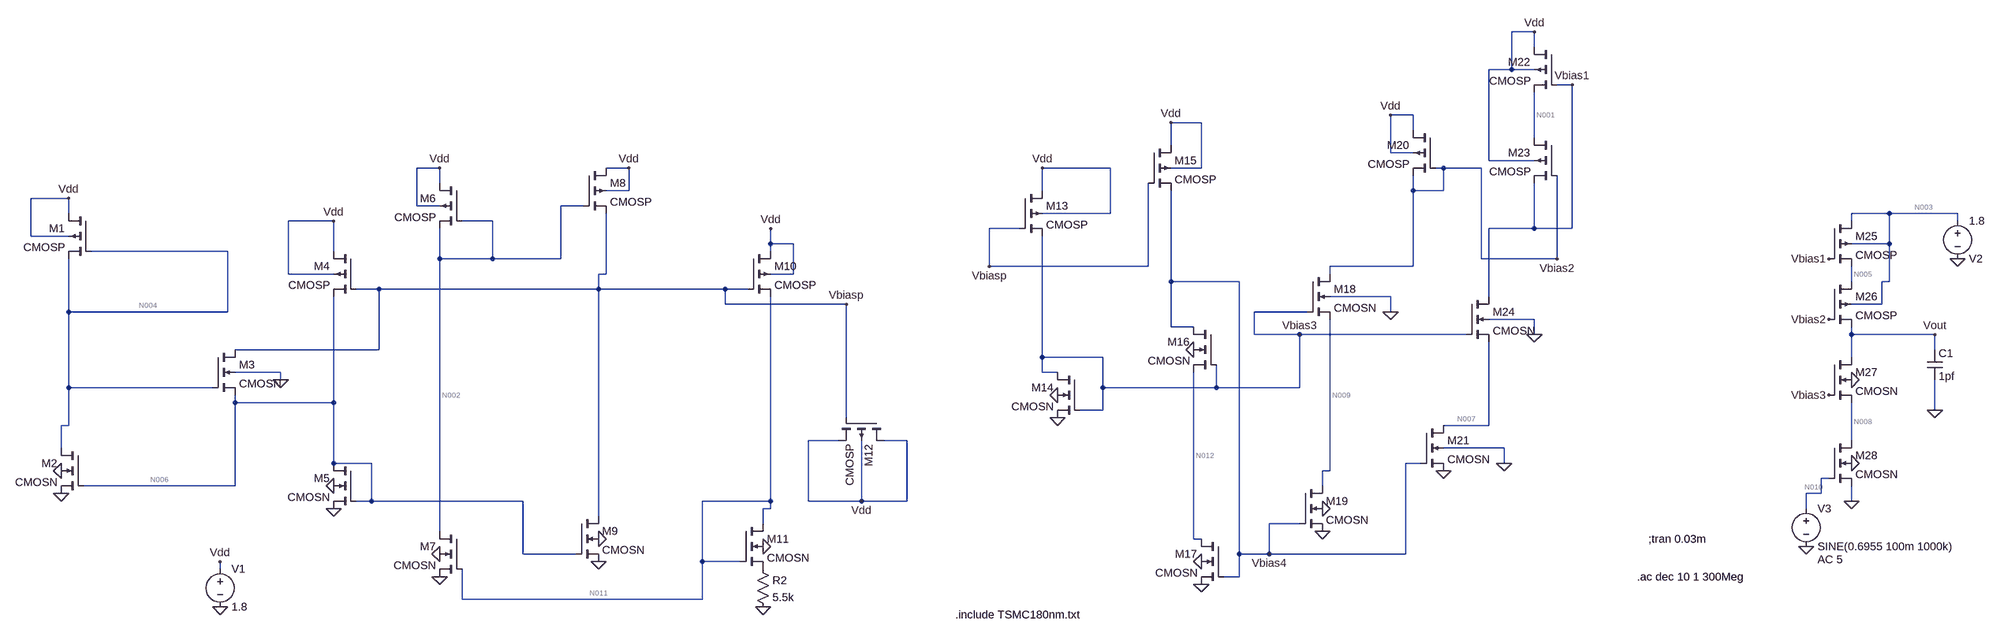
[diagram p0: schematic LTSPICE_180nm.asc]
LTSPICE_180nm.asc, the LTspice schematic file:
Version 4
SHEET 1 5252 2564
WIRE 2800 1024 2752 1024
WIRE 2800 1056 2800 1024
WIRE 2752 1104 2752 1024
WIRE 2752 1104 2704 1104
WIRE 2800 1104 2752 1104
WIRE 2880 1136 2848 1136
WIRE 2544 1200 2496 1200
WIRE 2096 1216 2032 1216
WIRE 2544 1232 2544 1200
WIRE 2800 1248 2800 1152
WIRE 2032 1264 2032 1216
WIRE 2496 1280 2496 1200
WIRE 2544 1280 2496 1280
WIRE 2704 1296 2704 1104
WIRE 2800 1296 2704 1296
WIRE 336 1312 288 1312
WIRE 736 1312 688 1312
WIRE 1904 1312 1760 1312
WIRE 2096 1312 2096 1216
WIRE 2096 1312 2032 1312
WIRE 2608 1312 2592 1312
WIRE 2688 1312 2608 1312
WIRE 336 1344 336 1312
WIRE 736 1360 736 1312
WIRE 736 1360 688 1360
WIRE 1760 1360 1760 1312
WIRE 2544 1360 2544 1328
WIRE 2608 1360 2608 1312
WIRE 2608 1360 2544 1360
WIRE -448 1376 -528 1376
WIRE 288 1392 288 1312
WIRE 336 1392 288 1392
WIRE 640 1392 592 1392
WIRE -448 1408 -448 1376
WIRE 1904 1408 1904 1312
WIRE 1904 1408 1760 1408
WIRE 4064 1408 3984 1408
WIRE 4208 1408 4064 1408
WIRE 112 1424 16 1424
WIRE 448 1424 384 1424
WIRE 3984 1424 3984 1408
WIRE 4208 1424 4208 1408
WIRE 1712 1440 1648 1440
WIRE 2800 1440 2800 1344
WIRE 2800 1440 2704 1440
WIRE 2880 1440 2880 1136
WIRE 2880 1440 2800 1440
WIRE -528 1456 -528 1376
WIRE -448 1456 -528 1456
WIRE 1104 1472 1104 1440
WIRE 1152 1472 1104 1472
WIRE 4064 1472 4064 1408
WIRE 4064 1472 3984 1472
WIRE -112 1488 -400 1488
WIRE 112 1488 112 1424
WIRE 1104 1488 1104 1472
WIRE 336 1504 336 1440
WIRE 448 1504 448 1424
WIRE 448 1504 336 1504
WIRE 592 1504 592 1392
WIRE 592 1504 448 1504
WIRE 2688 1504 2688 1312
WIRE 2848 1504 2848 1328
WIRE 2848 1504 2688 1504
WIRE 1648 1520 1648 1440
WIRE 1984 1520 1984 1344
WIRE 1984 1520 1648 1520
WIRE 2544 1520 2544 1360
WIRE 2544 1520 2368 1520
WIRE 16 1536 16 1424
WIRE 112 1536 16 1536
WIRE 688 1536 688 1408
WIRE 688 1536 672 1536
WIRE 1152 1536 1152 1472
WIRE 1152 1536 1104 1536
WIRE 2368 1536 2368 1520
WIRE 2032 1552 2032 1360
WIRE 2176 1552 2032 1552
WIRE 3984 1552 3984 1520
WIRE 4064 1552 4064 1472
WIRE 4064 1552 4048 1552
WIRE 208 1568 160 1568
WIRE 672 1568 672 1536
WIRE 672 1568 208 1568
WIRE 1008 1568 672 1568
WIRE 1056 1568 1008 1568
WIRE 2496 1584 2368 1584
WIRE 2704 1584 2704 1440
WIRE 1008 1600 1008 1568
WIRE 1264 1600 1008 1600
WIRE 4048 1600 4048 1552
WIRE 4048 1600 3984 1600
WIRE -448 1616 -448 1504
WIRE -112 1616 -112 1488
WIRE -112 1616 -448 1616
WIRE 2320 1616 2208 1616
WIRE 2496 1616 2496 1584
WIRE 2800 1632 2704 1632
WIRE 2032 1648 2032 1552
WIRE 2080 1648 2032 1648
WIRE 2208 1664 2208 1616
WIRE 2304 1664 2208 1664
WIRE 2656 1664 2304 1664
WIRE 2800 1664 2800 1632
WIRE 3984 1664 3984 1648
WIRE 4160 1664 3984 1664
WIRE 208 1696 208 1568
WIRE 208 1696 -96 1696
WIRE 4160 1696 4160 1664
WIRE 1760 1712 1760 1456
WIRE 1888 1712 1760 1712
WIRE 3984 1712 3984 1664
WIRE 0 1744 -96 1744
WIRE 1760 1744 1760 1712
WIRE 1792 1744 1760 1744
WIRE 0 1760 0 1744
WIRE -448 1776 -448 1616
WIRE -144 1776 -448 1776
WIRE 1888 1776 1888 1712
WIRE 2128 1776 2128 1728
WIRE 2128 1776 1888 1776
WIRE 2304 1776 2304 1664
WIRE 2304 1776 2128 1776
WIRE -96 1808 -96 1792
WIRE 112 1808 112 1584
WIRE 112 1808 -96 1808
WIRE 1888 1824 1888 1776
WIRE 1888 1824 1840 1824
WIRE 4160 1824 4160 1760
WIRE 1264 1840 1264 1600
WIRE -448 1856 -448 1776
WIRE -448 1856 -464 1856
WIRE 2704 1856 2704 1680
WIRE 2704 1856 2608 1856
WIRE 1248 1888 1184 1888
WIRE 1392 1888 1344 1888
WIRE 3984 1888 3984 1808
WIRE -464 1904 -464 1856
WIRE 2736 1904 2608 1904
WIRE 112 1936 112 1808
WIRE 192 1936 112 1936
WIRE 2560 1936 2528 1936
WIRE 2736 1936 2736 1904
WIRE 2368 1952 2368 1632
WIRE 2368 1952 2352 1952
WIRE 3936 1968 3920 1968
WIRE -96 1984 -96 1808
WIRE -96 1984 -416 1984
WIRE 2352 1984 2352 1952
WIRE 3920 2000 3920 1968
WIRE 3920 2000 3888 2000
WIRE 192 2016 192 1936
WIRE 192 2016 160 2016
WIRE 512 2016 192 2016
WIRE 1104 2016 1104 1584
WIRE 1104 2016 960 2016
WIRE 1184 2016 1184 1888
WIRE 1296 2016 1296 1888
WIRE 1296 2016 1184 2016
WIRE 1392 2016 1392 1888
WIRE 1392 2016 1296 2016
WIRE 3984 2016 3984 1984
WIRE 1104 2032 1104 2016
WIRE 1104 2032 1088 2032
WIRE 3888 2032 3888 2000
WIRE 672 2048 672 1568
WIRE 1088 2064 1088 2032
WIRE 2304 2064 2240 2064
WIRE 336 2080 336 1504
WIRE 2080 2096 2080 1744
WIRE 2096 2096 2080 2096
WIRE 512 2128 512 2016
WIRE 624 2128 512 2128
WIRE 2176 2128 2176 1552
WIRE 2240 2128 2240 2064
WIRE 2240 2128 2176 2128
WIRE 2528 2128 2528 1936
WIRE 2528 2128 2240 2128
WIRE 960 2144 960 2016
WIRE 1040 2144 960 2144
WIRE -128 2160 -128 2144
WIRE 2176 2176 2176 2128
WIRE 2176 2176 2144 2176
WIRE 384 2224 384 2160
WIRE 960 2224 960 2144
WIRE 960 2224 384 2224
FLAG -464 2000 0
FLAG 112 2032 0
FLAG 336 2176 0
FLAG 672 2144 0
FLAG -464 1952 0
FLAG 112 1984 0
FLAG 336 2128 0
FLAG 672 2096 0
FLAG 1088 2112 0
FLAG 1088 2240 0
FLAG 2096 2192 0
FLAG 2352 2080 0
FLAG 2096 2144 0
FLAG 2352 2032 0
FLAG 1792 1840 0
FLAG 1792 1792 0
FLAG 2080 1696 0
FLAG 2496 1616 0
FLAG 2608 1952 0
FLAG 4160 1824 0
FLAG 4208 1504 0
FLAG 3888 2112 0
FLAG 3984 2016 0
FLAG 4160 1664 Vout
FLAG 3984 1936 0
FLAG 3984 1760 0
FLAG 1264 1600 Vbiasp
FLAG 1648 1520 Vbiasp
FLAG 2304 1664 Vbias3
FLAG 2240 2128 Vbias4
FLAG 2880 1136 Vbias1
FLAG 2848 1504 Vbias2
FLAG 3936 1504 Vbias1
FLAG 3936 1632 Vbias2
FLAG 3936 1792 Vbias3
FLAG -128 2240 0
FLAG -128 2144 Vdd
FLAG -448 1376 Vdd
FLAG 112 1424 Vdd
FLAG 336 1312 Vdd
FLAG 736 1312 Vdd
FLAG 1296 2016 Vdd
FLAG 1104 1440 Vdd
FLAG 1760 1312 Vdd
FLAG 2032 1216 Vdd
FLAG 2496 1200 Vdd
FLAG 2800 1024 Vdd
FLAG 0 1760 0
FLAG 2800 1664 0
FLAG 2736 1936 0
SYMBOL pmos4 -400 1408 M0
SYMATTR InstName M1
SYMATTR Value2 l=3600n w=1800n
SYMATTR Value CMOSP
SYMBOL pmos4 160 1488 M0
SYMATTR InstName M4
SYMATTR Value2 l=360n w=4320n
SYMATTR Value CMOSP
SYMBOL pmos4 384 1344 M0
SYMATTR InstName M6
SYMATTR Value2 l=360n w=4320n
SYMATTR Value CMOSP
SYMBOL pmos4 640 1312 R0
SYMATTR InstName M8
SYMATTR Value2 l=360n w=4320n
SYMATTR Value CMOSP
SYMBOL pmos4 1056 1488 R0
SYMATTR InstName M10
SYMATTR Value2 l=360n w=4320n
SYMATTR Value CMOSP
SYMBOL nmos4 -144 1696 R0
SYMATTR InstName M3
SYMATTR Value2 l=360n w=720n
SYMATTR Value CMOSN
SYMBOL nmos4 -416 1904 M0
SYMATTR InstName M2
SYMATTR Value2 l=360n w=1800n
SYMATTR Value CMOSN
SYMBOL nmos4 160 1936 M0
SYMATTR InstName M5
SYMATTR Value2 l=360n w=1800n
SYMATTR Value CMOSN
SYMBOL nmos4 384 2080 M0
SYMATTR InstName M7
SYMATTR Value2 l=360n w=1800n
SYMATTR Value CMOSN
SYMBOL nmos4 624 2048 R0
SYMATTR InstName M9
SYMATTR Value2 l=360n w=1800n
SYMATTR Value CMOSN
SYMBOL nmos4 1040 2064 R0
SYMATTR InstName M11
SYMATTR Value2 l=360n w=5400n
SYMATTR Value CMOSN
SYMBOL pmos4 1344 1840 R90
SYMATTR InstName M12
SYMATTR Value2 l=9000n w=9000n
SYMATTR Value CMOSP
SYMBOL res 1072 2144 R0
SYMATTR InstName R2
SYMATTR Value 5.5k
SYMBOL nmos4 2144 2096 M0
SYMATTR InstName M17
SYMATTR Value2 l=360n w=1800n
SYMATTR Value CMOSN
SYMBOL nmos4 2304 1984 R0
SYMATTR InstName M19
SYMATTR Value2 l=360n w=1800n
SYMATTR Value CMOSN
SYMBOL nmos4 1840 1744 M0
SYMATTR InstName M14
SYMATTR Value2 l=1206n w=360n
SYMATTR Value CMOSN
SYMBOL nmos4 2128 1648 M0
SYMATTR InstName M16
SYMATTR Value2 l=360n w=1800n
SYMATTR Value CMOSN
SYMBOL nmos4 2320 1536 R0
SYMATTR InstName M18
SYMATTR Value2 l=360n w=1980n
SYMATTR Value CMOSN
SYMBOL nmos4 2560 1856 R0
SYMATTR InstName M21
SYMATTR Value2 l=360n w=1800n
SYMATTR Value CMOSN
SYMBOL nmos4 2656 1584 R0
SYMATTR InstName M24
SYMATTR Value2 l=360n w=1800n
SYMATTR Value CMOSN
SYMBOL pmos4 1712 1360 R0
SYMATTR InstName M13
SYMATTR Value2 l=360n w=4320n
SYMATTR Value CMOSP
SYMBOL pmos4 2592 1232 M0
SYMATTR InstName M20
SYMATTR Value2 l=900n w=1190n
SYMATTR Value CMOSP
SYMBOL pmos4 1984 1264 R0
SYMATTR InstName M15
SYMATTR Value2 l=360n w=4320n
SYMATTR Value CMOSP
SYMBOL pmos4 2848 1056 M0
SYMATTR InstName M22
SYMATTR Value2 l=360n w=1170n
SYMATTR Value CMOSP
SYMBOL pmos4 2848 1248 M0
SYMATTR InstName M23
SYMATTR Value2 l=360n w=3250n
SYMATTR Value CMOSP
SYMBOL voltage 4208 1408 R0
WINDOW 0 24 96 Left 2
WINDOW 3 24 16 Left 2
WINDOW 123 0 0 Left 0
WINDOW 39 0 0 Left 0
SYMATTR InstName V2
SYMATTR Value 1.8
SYMBOL voltage 3888 2016 R0
WINDOW 123 24 124 Left 2
WINDOW 39 0 0 Left 0
SYMATTR Value2 AC 5
SYMATTR InstName V3
SYMATTR Value SINE(0.6955 100m 1000k)
SYMBOL cap 4144 1696 R0
SYMATTR InstName C1
SYMATTR Value 1pf
SYMBOL nmos4 3936 1888 R0
SYMATTR InstName M28
SYMATTR Value2 l=180n w=709.27n
SYMATTR Value CMOSN
SYMBOL nmos4 3936 1712 R0
SYMATTR InstName M27
SYMATTR Value2 l=180n w=709.27n
SYMATTR Value CMOSN
SYMBOL pmos4 3936 1552 R0
SYMATTR InstName M26
SYMATTR Value2 l=180n w=3494.55n
SYMATTR Value CMOSP
SYMBOL pmos4 3936 1424 R0
SYMATTR InstName M25
SYMATTR Value2 l=180n w=3494.55n
SYMATTR Value CMOSP
SYMBOL voltage -128 2144 R0
WINDOW 123 0 0 Left 0
WINDOW 39 0 0 Left 0
SYMATTR InstName V1
SYMATTR Value 1.8
TEXT 3264 2176 Left 2 !.ac dec 10 1 300Meg
TEXT 3288 2096 Left 2 !;tran 0.03m
TEXT 1576 2256 Left 2 !.include TSMC180nm.txt

The netlist it stands for:
* LTSPICE_180nm.asc
M1 Vdd N004 N004 Vdd CMOSP l=3600n w=1800n
M4 Vdd Vbiasp N006 Vdd CMOSP l=360n w=4320n
M6 Vdd N002 N002 Vdd CMOSP l=360n w=4320n
M8 Vdd N002 Vbiasp Vdd CMOSP l=360n w=4320n
M10 Vdd Vbiasp N011 Vdd CMOSP l=360n w=4320n
M3 Vbiasp N004 N006 0 CMOSN l=360n w=720n
M2 N004 N006 0 0 CMOSN l=360n w=1800n
M5 N006 N006 0 0 CMOSN l=360n w=1800n
M7 N002 N011 0 0 CMOSN l=360n w=1800n
M9 Vbiasp N006 0 0 CMOSN l=360n w=1800n
M11 N011 N011 P001 0 CMOSN l=360n w=5400n
M12 Vdd Vbiasp Vdd Vdd CMOSP l=9000n w=9000n
R2 P001 0 5.5k
M17 N012 Vbias4 0 0 CMOSN l=360n w=1800n
M19 N009 Vbias4 0 0 CMOSN l=360n w=1800n
M14 Vbias3 Vbias3 0 0 CMOSN l=1206n w=360n
M16 Vbias4 Vbias3 N012 0 CMOSN l=360n w=1800n
M18 Vbias2 Vbias3 N009 0 CMOSN l=360n w=1980n
M21 N007 Vbias4 0 0 CMOSN l=360n w=1800n
M24 Vbias1 Vbias3 N007 0 CMOSN l=360n w=1800n
M13 Vdd Vbiasp Vbias3 Vdd CMOSP l=360n w=4320n
M20 Vdd Vbias2 Vbias2 Vdd CMOSP l=900n w=1190n
M15 Vdd Vbiasp Vbias4 Vdd CMOSP l=360n w=4320n
M22 Vdd Vbias1 N001 Vdd CMOSP l=360n w=1170n
M23 N001 Vbias2 Vbias1 Vdd CMOSP l=360n w=3250n
V2 N003 0 1.8
V3 N010 0 SINE(0.6955 100m 1000k) AC 5
C1 Vout 0 1pf
M28 N008 N010 0 0 CMOSN l=180n w=709.27n
M27 Vout Vbias3 N008 0 CMOSN l=180n w=709.27n
M26 N005 Vbias2 Vout N003 CMOSP l=180n w=3494.55n
M25 N003 Vbias1 N005 N003 CMOSP l=180n w=3494.55n
V1 Vdd 0 1.8
.model NMOS NMOS
.model PMOS PMOS
.lib standard.mos
.ac dec 10 1 300Meg
;tran 0.03m
.include TSMC180nm.txt
.backanno
.end

* Results of the author's LTspice run, read from the files saved beside the schematic
* Operating Point, zero values left out:
*   V(vdd) = 1.8 V
*   V(n004) = 583.5 mV
*   V(vbiasp) = 1.223 V
*   V(n006) = 559.5 mV
*   V(n002) = 1.209 V
*   V(n011) = 559.8 mV
*   V(p001) = 44.12 mV
*   V(n012) = 239.2 mV
*   V(vbias4) = 564.6 mV
*   V(n009) = 246.9 mV
*   V(vbias3) = 864.9 mV
*   V(vbias2) = 911 mV
*   V(n007) = 244.1 mV
*   V(vbias1) = 1.067 V
*   V(n001) = 1.58 V
*   V(n003) = 1.8 V
*   V(n010) = 695.5 mV
*   V(vout) = 1.62 V
*   V(n008) = 180.7 mV
*   V(n005) = 1.701 V
*   Id(M1) = 8.059 µA
*   Ib(M1) = 1.226 pA
*   Is(M1) = -8.059 µA
*   Id(M4) = 8.023 µA
*   Ib(M4) = 1.25 pA
*   Is(M4) = -8.023 µA
*   Id(M6) = 8.956 µA
*   Is(M6) = -8.956 µA
*   Id(M8) = 8.937 µA
*   Is(M8) = -8.937 µA
*   Id(M10) = 8.022 µA
*   Ib(M10) = 1.25 pA
*   Is(M10) = -8.022 µA
*   Id(M13) = 7.757 µA
*   Is(M13) = -7.757 µA
*   Id(M20) = 8.044 µA
*   Is(M20) = -8.044 µA
*   Id(M15) = 8.018 µA
*   Ib(M15) = 1.245 pA
*   Is(M15) = -8.018 µA
*   Id(M22) = 8.034 µA
*   Is(M22) = -8.034 µA
*   Id(M23) = 8.034 µA
*   Is(M23) = -8.034 µA
*   Id(M26) = 28.46 µA
*   Is(M26) = -28.46 µA
*   Id(M25) = 28.46 µA
*   Is(M25) = -28.46 µA
*   Id(M3) = 1.278 pA
*   Ib(M3) = -1.803 pA
*   Id(M2) = 8.059 µA
*   Is(M2) = -8.059 µA
*   Id(M5) = 8.023 µA
*   Is(M5) = -8.023 µA
*   Id(M7) = 8.956 µA
*   Ib(M7) = -1.219 pA
*   Is(M7) = -8.956 µA
*   Id(M9) = 8.937 µA
*   Ib(M9) = -1.233 pA
*   Is(M9) = -8.937 µA
*   Id(M11) = 8.022 µA
*   Is(M11) = -8.022 µA
*   Id(M17) = 8.018 µA
*   Is(M17) = -8.018 µA
*   Id(M19) = 8.044 µA
*   Is(M19) = -8.044 µA
*   Id(M14) = 7.757 µA
*   Is(M14) = -7.757 µA
*   Id(M16) = 8.018 µA
*   Is(M16) = -8.018 µA
*   Id(M18) = 8.044 µA
*   Ib(M18) = -1.178 pA
*   Is(M18) = -8.044 µA
*   Id(M21) = 8.034 µA
*   Is(M21) = -8.034 µA
*   Id(M24) = 8.034 µA
*   Ib(M24) = -1.331 pA
*   Is(M24) = -8.034 µA
*   Id(M28) = 28.46 µA
*   Is(M28) = -28.46 µA
*   Id(M27) = 28.46 µA
*   Ib(M27) = -1.821 pA
*   Is(M27) = -28.46 µA
*   I(R2) = 8.022 µA
*   I(V2) = -28.46 µA
*   I(V1) = -73.85 µA
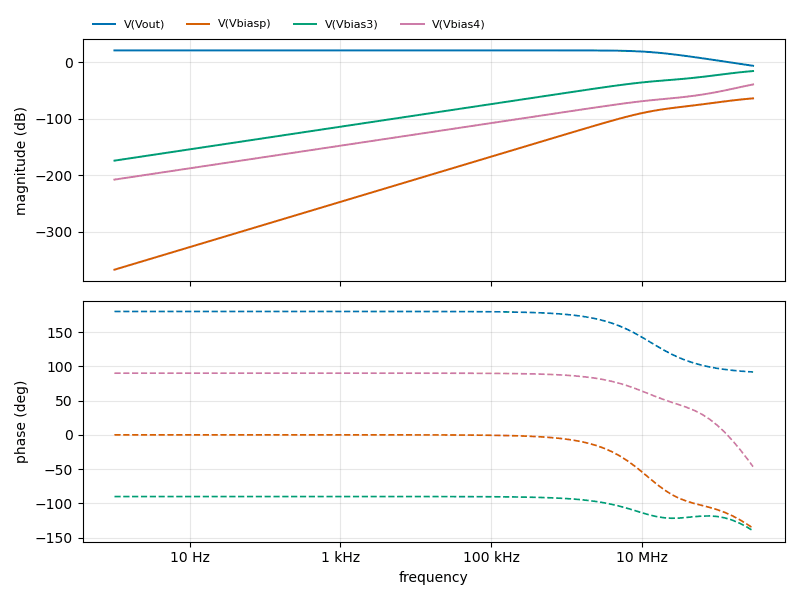
[diagram p1: AC Analysis of LTSPICE_180nm.asc, plotted from the saved traces]
* AC Analysis, 1 run:
*   V(Vout): 20.75 dB at 1 Hz, -6.48 dB at 300 MHz, peak 20.75 dB at 1 Hz, 3 dB below the peak at 13.05 MHz
*   V(Vbiasp): -367.24 dB at 1 Hz, -64.16 dB at 300 MHz, peak -64.16 dB at 300 MHz, 3 dB below the peak at 175.9 MHz
*   V(Vbias3): -174.28 dB at 1 Hz, -15.79 dB at 300 MHz, peak -15.79 dB at 300 MHz, 3 dB below the peak at 177.2 MHz
*   V(Vbias4): -207.85 dB at 1 Hz, -39.47 dB at 300 MHz, peak -39.47 dB at 300 MHz, 3 dB below the peak at 233.1 MHz